# Altium schematic sheet Perechen_Elementov (1).schdoc
size 209 x 297 mm
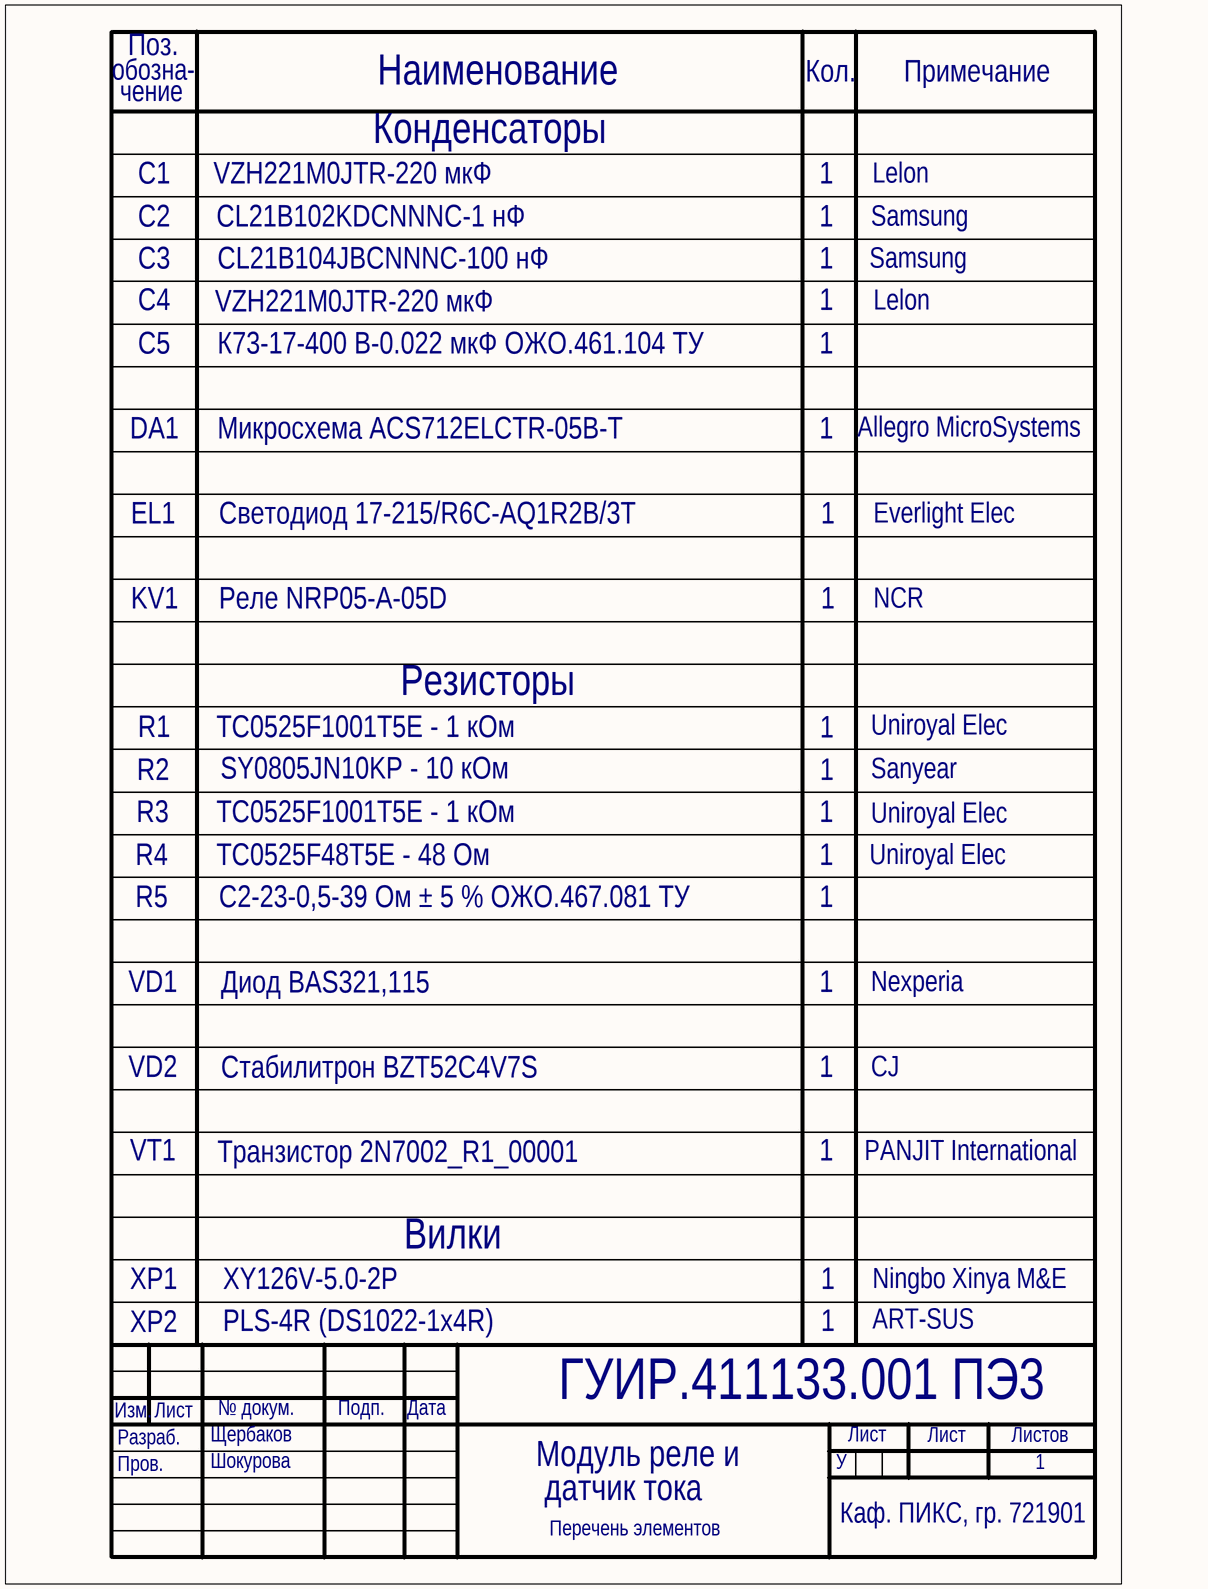
[diagram p0: Perechen_Elementov (1).schdoc]

## Notes on the sheet
- Поз.
- обозна-
- чение
- Наименование
- Кол.
- Примечание
- С1
- VZH221M0JTR-220 мкФ
- Конденсаторы
- 1
- Lelon
- С2
- CL21B102KDCNNNC-1 нФ
- Samsung
- С3
- С4
- CL21B104JBCNNNC-100 нФ
- С5
- К73-17-400 В-0.022 мкФ ОЖО.461.104 ТУ
- DA1
- Микросхема ACS712ELCTR-05B-T
- Allegro MicroSystems
- EL1
- Светодиод 17-215/R6C-AQ1R2B/3T
- Everlight Elec
- KV1
- Реле NRP05-A-05D
- NCR
- Резисторы
- R2
- R1
- TC0525F1001T5E - 1 кОм
- SY0805JN10KP - 10 кОм
- Uniroyal Elec
- Sanyear
- R4
- R3
- TC0525F48T5E - 48 Ом
- R5
- С2-23-0,5-39 Ом ± 5 % ОЖО.467.081 ТУ
- VD1
- Диод BAS321,115
- Nexperia
- VD2
- Стабилитрон BZT52C4V7S
- CJ
- VT1
- Транзистор 2N7002_R1_00001
- PANJIT International
- Вилки
- XP1
- XP2
- XY126V-5.0-2P
- PLS-4R (DS1022-1x4R)
- Ningbo Xinya M&E
- ART-SUS
- ГУИР.411133.001 ПЭ3
- Изм.
- Разраб.
- Пров.
- Лист
- Щербаков
- Шокурова
- № докум.
- Подп.
- Дата
- Модуль реле и
- У
- Листов
- датчик тока
- Перечень элементов
- Каф. ПИКС, гр. 721901